# EAGLE design apa104-breakout (EAGLE 9.1.3)
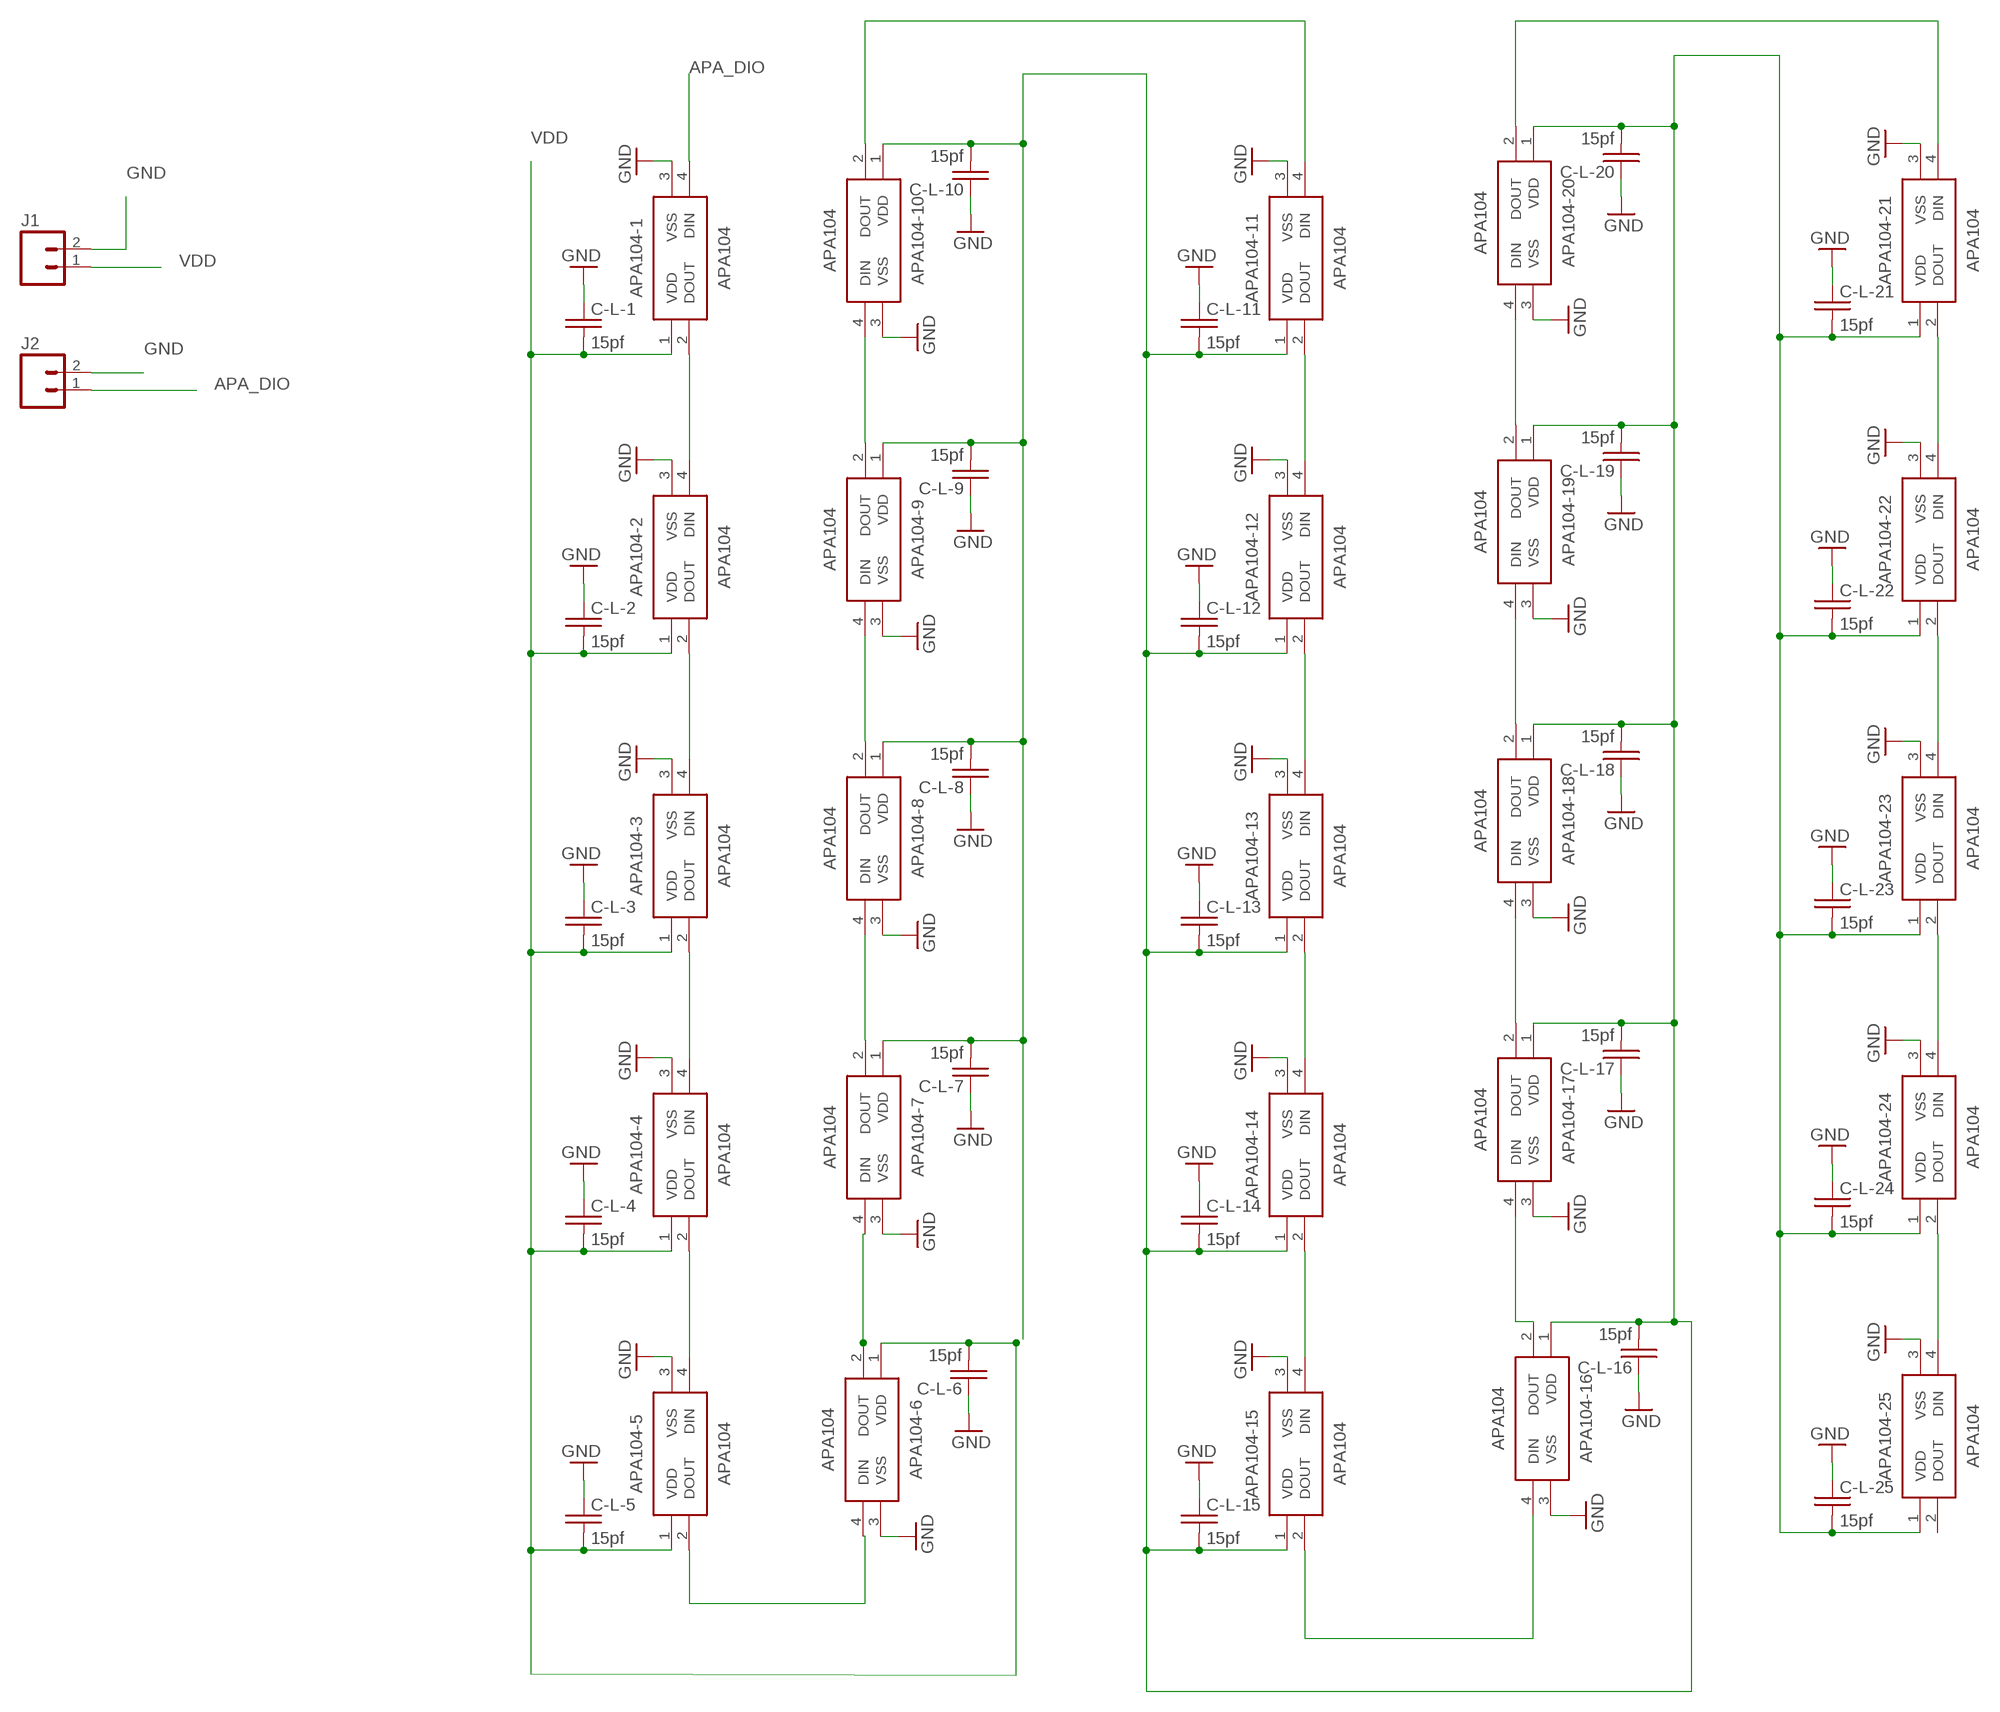
[diagram p0: schematic, sheet 1]

## Parts
APA104-1  APA104  [APA104]
APA104-2  APA104  [APA104]
APA104-3  APA104  [APA104]
APA104-4  APA104  [APA104]
APA104-5  APA104  [APA104]
APA104-6  APA104  [APA104]
APA104-7  APA104  [APA104]
APA104-8  APA104  [APA104]
APA104-9  APA104  [APA104]
APA104-10  APA104  [APA104]
APA104-11  APA104  [APA104]
APA104-12  APA104  [APA104]
APA104-13  APA104  [APA104]
APA104-14  APA104  [APA104]
APA104-15  APA104  [APA104]
APA104-16  APA104  [APA104]
APA104-17  APA104  [APA104]
APA104-18  APA104  [APA104]
APA104-19  APA104  [APA104]
APA104-20  APA104  [APA104]
APA104-21  APA104  [APA104]
APA104-22  APA104  [APA104]
APA104-23  APA104  [APA104]
APA104-24  APA104  [APA104]
APA104-25  APA104  [APA104]
C-L-1  15pf  C-USC0805-VOLTERA  [C0805-VOLTA]
C-L-2  15pf  C-USC0805-VOLTERA  [C0805-VOLTA]
C-L-3  15pf  C-USC0805-VOLTERA  [C0805-VOLTA]
C-L-4  15pf  C-USC0805-VOLTERA  [C0805-VOLTA]
C-L-5  15pf  C-USC0805-VOLTERA  [C0805-VOLTA]
C-L-6  15pf  C-USC0805-VOLTERA  [C0805-VOLTA]
C-L-7  15pf  C-USC0805-VOLTERA  [C0805-VOLTA]
C-L-8  15pf  C-USC0805-VOLTERA  [C0805-VOLTA]
C-L-9  15pf  C-USC0805-VOLTERA  [C0805-VOLTA]
C-L-10  15pf  C-USC0805-VOLTERA  [C0805-VOLTA]
C-L-11  15pf  C-USC0805-VOLTERA  [C0805-VOLTA]
C-L-12  15pf  C-USC0805-VOLTERA  [C0805-VOLTA]
C-L-13  15pf  C-USC0805-VOLTERA  [C0805-VOLTA]
C-L-14  15pf  C-USC0805-VOLTERA  [C0805-VOLTA]
C-L-15  15pf  C-USC0805-VOLTERA  [C0805-VOLTA]
C-L-16  15pf  C-USC0805-VOLTERA  [C0805-VOLTA]
C-L-17  15pf  C-USC0805-VOLTERA  [C0805-VOLTA]
C-L-18  15pf  C-USC0805-VOLTERA  [C0805-VOLTA]
C-L-19  15pf  C-USC0805-VOLTERA  [C0805-VOLTA]
C-L-20  15pf  C-USC0805-VOLTERA  [C0805-VOLTA]
C-L-21  15pf  C-USC0805-VOLTERA  [C0805-VOLTA]
C-L-22  15pf  C-USC0805-VOLTERA  [C0805-VOLTA]
C-L-23  15pf  C-USC0805-VOLTERA  [C0805-VOLTA]
C-L-24  15pf  C-USC0805-VOLTERA  [C0805-VOLTA]
C-L-25  15pf  C-USC0805-VOLTERA  [C0805-VOLTA]
J1  M02PTH  [1X02]
J2  M02PTH  [1X02]

## Nets
APA_DIO: APA104-1.4(DIN) J2.1
GND: APA104-1.3(VSS) APA104-2.3(VSS) APA104-3.3(VSS) APA104-4.3(VSS) APA104-5.3(VSS) APA104-6.3(VSS) APA104-7.3(VSS) APA104-8.3(VSS) APA104-9.3(VSS) APA104-10.3(VSS) APA104-11.3(VSS) APA104-12.3(VSS) APA104-13.3(VSS) APA104-14.3(VSS) APA104-15.3(VSS) APA104-16.3(VSS) APA104-17.3(VSS) APA104-18.3(VSS) APA104-19.3(VSS) APA104-20.3(VSS) APA104-21.3(VSS) APA104-22.3(VSS) APA104-23.3(VSS) APA104-24.3(VSS) APA104-25.3(VSS) C-L-1.1 C-L-2.1 C-L-3.1 C-L-4.1 C-L-5.1 C-L-6.1 C-L-7.1 C-L-8.1 C-L-9.1 C-L-10.1 C-L-11.1 C-L-12.1 C-L-13.1 C-L-14.1 C-L-15.1 C-L-16.1 C-L-17.1 C-L-18.1 C-L-19.1 C-L-20.1 C-L-21.1 C-L-22.1 C-L-23.1 C-L-24.1 C-L-25.1 J1.2 J2.2
N$1: APA104-2.2(DOUT) APA104-3.4(DIN)
N$2: APA104-3.2(DOUT) APA104-4.4(DIN)
N$3: APA104-4.2(DOUT) APA104-5.4(DIN)
N$4: APA104-6.2(DOUT) APA104-7.4(DIN)
N$5: APA104-5.2(DOUT) APA104-6.4(DIN)
N$6: APA104-7.2(DOUT) APA104-8.4(DIN)
N$7: APA104-8.2(DOUT) APA104-9.4(DIN)
N$8: APA104-9.2(DOUT) APA104-10.4(DIN)
N$9: APA104-10.2(DOUT) APA104-11.4(DIN)
N$10: APA104-11.2(DOUT) APA104-12.4(DIN)
N$11: APA104-12.2(DOUT) APA104-13.4(DIN)
N$12: APA104-13.2(DOUT) APA104-14.4(DIN)
N$13: APA104-14.2(DOUT) APA104-15.4(DIN)
N$14: APA104-15.2(DOUT) APA104-16.4(DIN)
N$15: APA104-16.2(DOUT) APA104-17.4(DIN)
N$16: APA104-17.2(DOUT) APA104-18.4(DIN)
N$17: APA104-18.2(DOUT) APA104-19.4(DIN)
N$18: APA104-19.2(DOUT) APA104-20.4(DIN)
N$19: APA104-20.2(DOUT) APA104-21.4(DIN)
N$20: APA104-21.2(DOUT) APA104-22.4(DIN)
N$21: APA104-22.2(DOUT) APA104-23.4(DIN)
N$22: APA104-23.2(DOUT) APA104-24.4(DIN)
N$23: APA104-24.2(DOUT) APA104-25.4(DIN)
N$24: APA104-1.2(DOUT) APA104-2.4(DIN)
VDD: APA104-1.1(VDD) APA104-2.1(VDD) APA104-3.1(VDD) APA104-4.1(VDD) APA104-5.1(VDD) APA104-6.1(VDD) APA104-7.1(VDD) APA104-8.1(VDD) APA104-9.1(VDD) APA104-10.1(VDD) APA104-11.1(VDD) APA104-12.1(VDD) APA104-13.1(VDD) APA104-14.1(VDD) APA104-15.1(VDD) APA104-16.1(VDD) APA104-17.1(VDD) APA104-18.1(VDD) APA104-19.1(VDD) APA104-20.1(VDD) APA104-21.1(VDD) APA104-22.1(VDD) APA104-23.1(VDD) APA104-24.1(VDD) APA104-25.1(VDD) C-L-1.2 C-L-2.2 C-L-3.2 C-L-4.2 C-L-5.2 C-L-6.2 C-L-7.2 C-L-8.2 C-L-9.2 C-L-10.2 C-L-11.2 C-L-12.2 C-L-13.2 C-L-14.2 C-L-15.2 C-L-16.2 C-L-17.2 C-L-18.2 C-L-19.2 C-L-20.2 C-L-21.2 C-L-22.2 C-L-23.2 C-L-24.2 C-L-25.2 J1.1
Unconnected: APA104-25.2(DOUT)

## Library data of the parts
APA104-1-APA104-25 = name-in-lights:APA104: APA104 LED CHIP Source: Datasheet <http://www.ledlightinghut.com/files/APA104%20Datasheet.pdf>; DESCRIPTION: APA104 LED Chip; HEIGHT: mm; MANUFACTURER_NAME: Worldsemi; MANUFACTURER_PART_NUMBER: APA104; SUPPLIER_NAME: RS
C-L-1-C-L-25 = name-in-lights:C-US: CAPACITOR, American symbol
J1 J2 = apa104-test-board:M02: Standard 2-pin 0.1" header. Use with - straight break away headers ( PRT-00116) - right angle break away headers (PRT-00553) - swiss pins (PRT-00743) - machine pins (PRT-00117) - female headers (PRT-00115) Molex polarized connector foot print use with: PRT-08233 with associated crimp pins and housings. 2.54_SCREWTERM for use with PRT-10571. 3.5mm Screw Terminal footprints for PRT-08084 5mm Screw Terminal footprints for use with PRT-08432

## Board
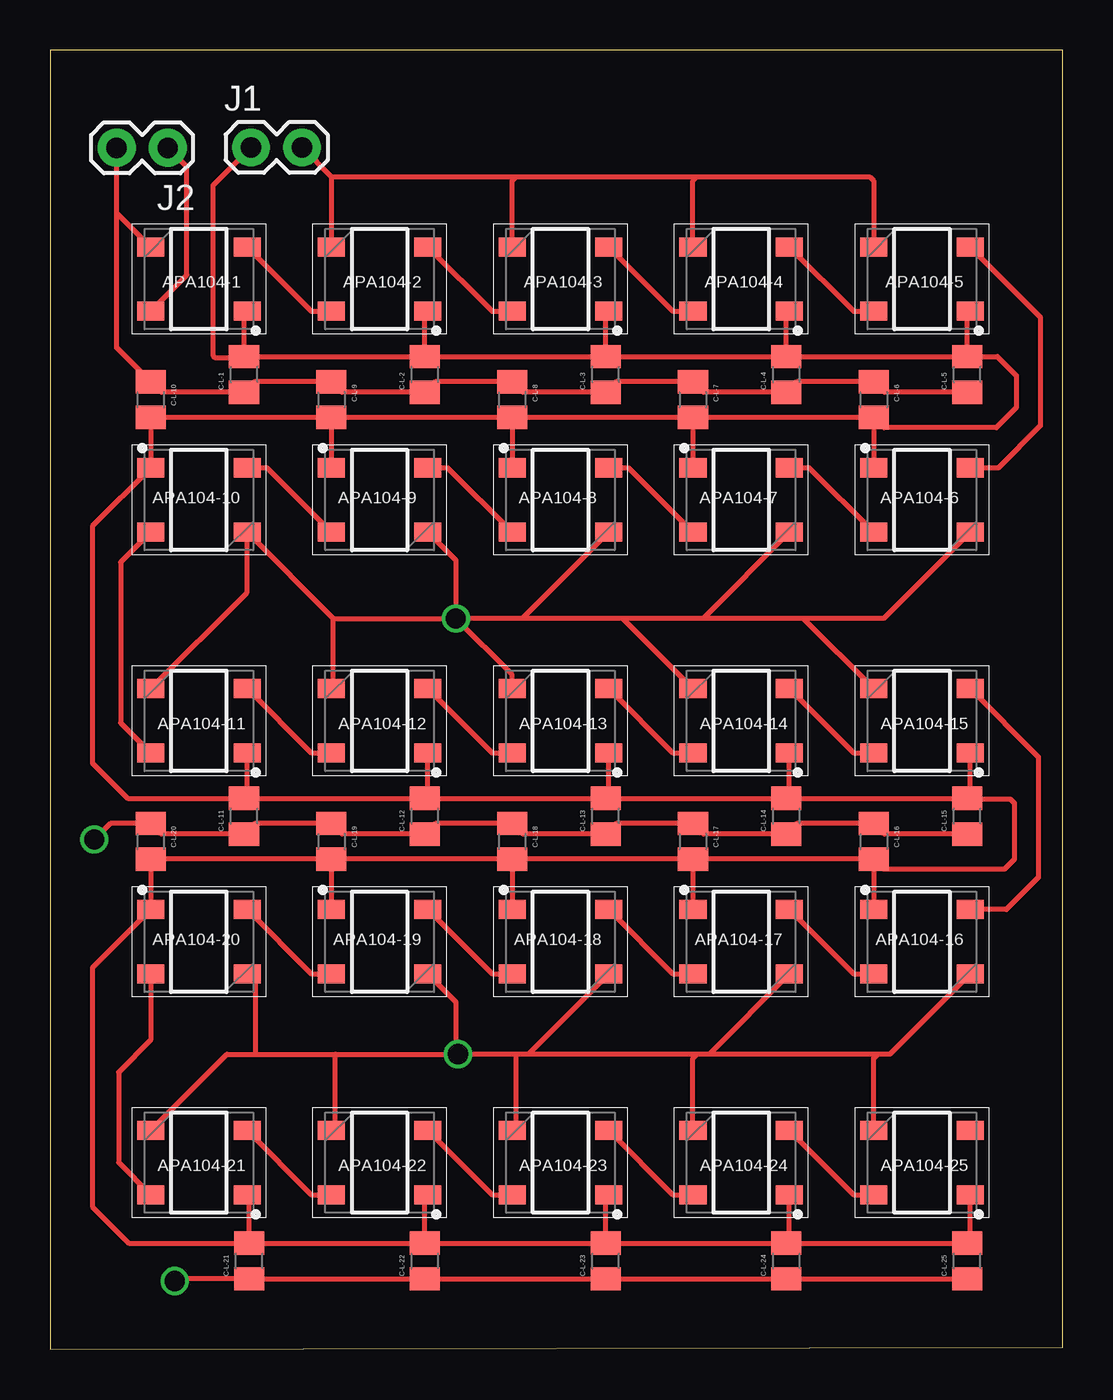
[diagram p1: board, top side]
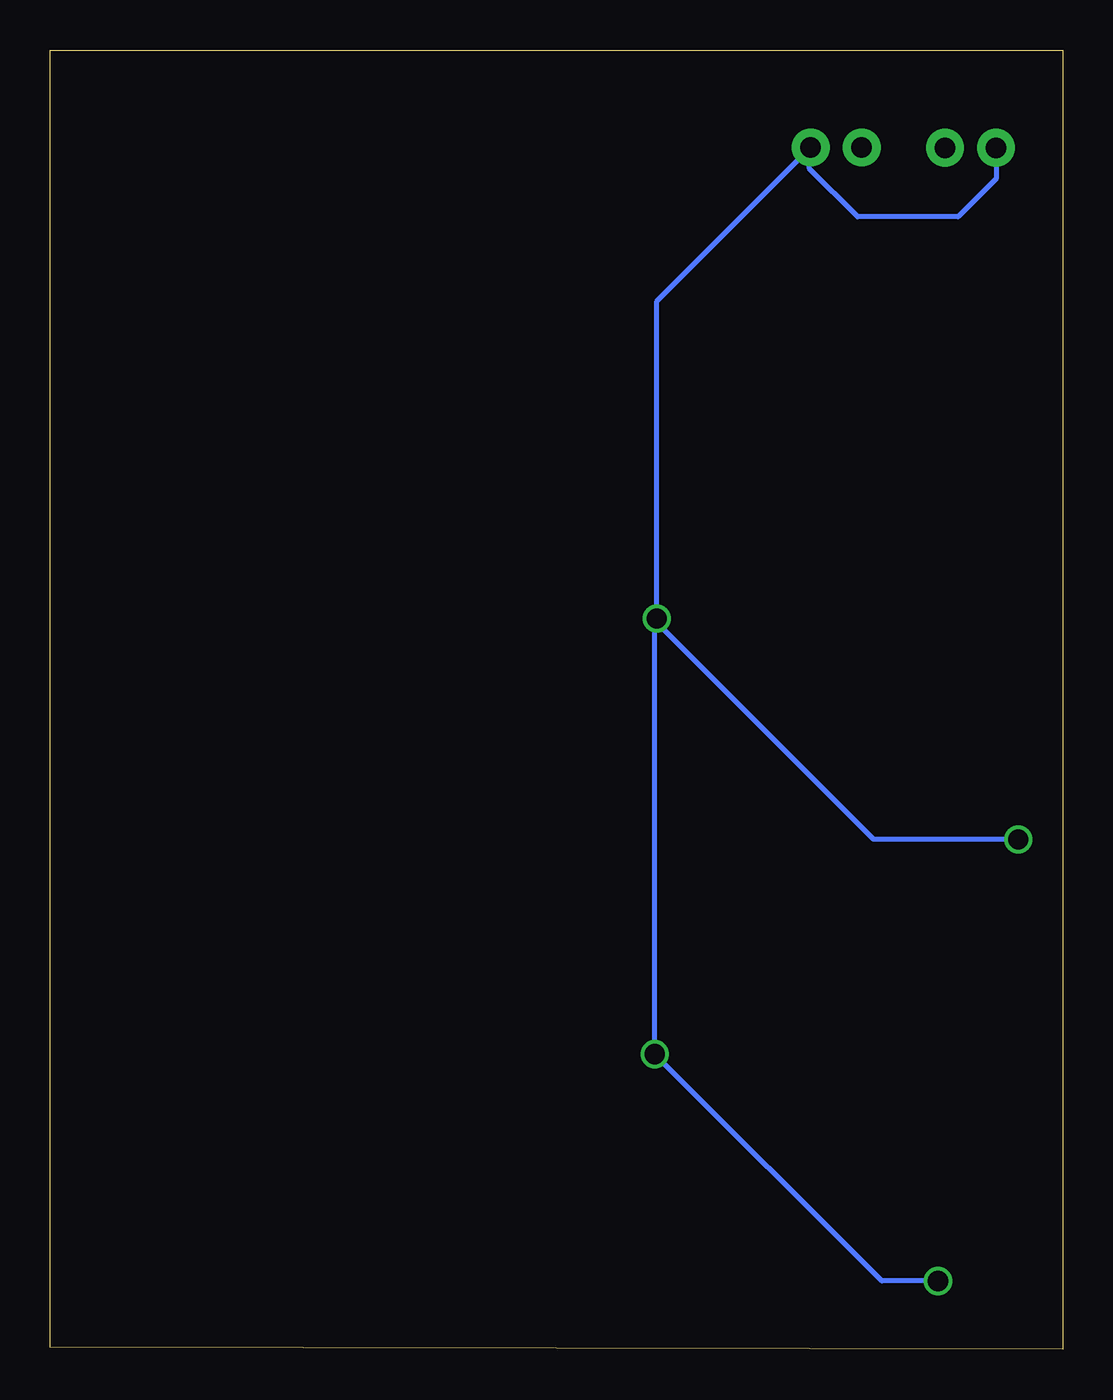
[diagram p2: board, bottom side, seen from below]

Size 50.4 x 64.7 mm. Coordinates in mm from the lower left corner, seen from the top.
Outline: 0,0 50.4,0.1 50.4,64.7 0,64.7 0,0
Copper layers (1*16): Top 0.035mm / dielectric 1.5mm / Bottom 0.035mm
Design rules "Voltera_DRC-my-adds": minimum track width 10mil, minimum drill 0.7mm, track to track 12mil, track to pad 12mil, pad to pad 0.6mm, via to via 0.6mm, smd to smd 0mil, copper to edge 0mil, drill to drill 0.8mm, minimum pad ring 0.2mm, minimum via ring 0.2mm, stop-mask expansion 4mil, vias tented up to drill 0mil, thermal gap 10mil

### Footprints (pad centres in the part's own frame; a part is rotated, then mirrored left to right if it is on the bottom)
APA104 = smd 1.35 x 0.95: 1 -2.4,1.6; 2 -2.4,-1.6; 3 2.4,-1.6; 4 2.4,1.6
C0805-VOLTA = smd 1.168 x 1.499: 1 -0.889,0; 2 0.889,0
1X02 = drill 1.016 pad 1.88: 1 0,0; 2 2.54,0

### Placement (x,y rotation side)
APA104-1  7.4,53.3 180 top
APA104-2  16.4,53.3 180 top
APA104-3  25.4,53.3 180 top
APA104-4  34.4,53.3 180 top
APA104-5  43.4,53.3 180 top
APA104-6  43.4,42.3 0 top
APA104-7  34.4,42.3 0 top
APA104-8  25.4,42.3 0 top
APA104-9  16.4,42.3 0 top
APA104-10  7.4,42.3 0 top
APA104-11  7.4,31.3 180 top
APA104-12  16.4,31.3 180 top
APA104-13  25.4,31.3 180 top
APA104-14  34.4,31.3 180 top
APA104-15  43.4,31.3 180 top
APA104-16  43.4,20.3 0 top
APA104-17  34.4,20.3 0 top
APA104-18  25.4,20.3 0 top
APA104-19  16.4,20.3 0 top
APA104-20  7.4,20.3 0 top
APA104-21  7.4,9.3 180 top
APA104-22  16.4,9.3 180 top
APA104-23  25.4,9.3 180 top
APA104-24  34.4,9.3 180 top
APA104-25  43.4,9.3 180 top
C-L-1  9.65,48.55 90 top
C-L-2  18.65,48.55 90 top
C-L-3  27.65,48.55 90 top
C-L-4  36.65,48.55 90 top
C-L-5  45.65,48.55 90 top
C-L-6  41,47.3 270 top
C-L-7  32,47.3 270 top
C-L-8  23,47.3 270 top
C-L-9  14,47.3 270 top
C-L-10  5,47.3 270 top
C-L-11  9.65,26.55 90 top
C-L-12  18.65,26.55 90 top
C-L-13  27.65,26.55 90 top
C-L-14  36.65,26.55 90 top
C-L-15  45.65,26.55 90 top
C-L-16  41,25.3 270 top
C-L-17  32,25.3 270 top
C-L-18  23,25.3 270 top
C-L-19  14,25.3 270 top
C-L-20  5,25.3 270 top
C-L-21  9.9,4.4 90 top
C-L-22  18.65,4.4 90 top
C-L-23  27.65,4.4 90 top
C-L-24  36.65,4.4 90 top
C-L-25  45.65,4.4 90 top
J1  10,59.86 0 top
J2  5.85,59.84 180 top

### Tracks (layer width: path | path; a pad name or v marks a point on that pad's centre or on a via)
APA_DIO
  Top 0.254: APA104-1.4 6.8,53.5 6.8,58.89 J2.1
GND  (via drill 1)
  Top 0.254: J1.2 14,58.4 | 14,58.4 APA104-2.3 | 14,58.4 23.2,58.4 | 23.2,58.4 32.2,58.4 | C-L-5.1 41.53,47.66 C-L-6.1 37.18,48.19 C-L-4.1 32.53,47.66 C-L-7.1 28.18,48.19 C-L-3.1 23.53,47.66 C-L-8.1 19.18,48.19 C-L-2.1 14.53,47.66 C-L-9.1 10.18,48.19 C-L-1.1 5.53,47.66 5.09,48.09 C-L-10.1 3.31,49.88 3.31,56.59 | APA104-11.3 9.8,37.7 APA104-10.3 14.1,36.4 | C-L-15.1 41.53,25.66 C-L-16.1 37.18,26.19 C-L-14.1 32.53,25.66 C-L-17.1 28.18,26.19 C-L-13.1 23.53,25.66 C-L-18.1 19.18,26.19 C-L-12.1 14.53,25.66 C-L-19.1 10.18,26.19 C-L-11.1 5.53,25.66 C-L-20.1 2.99,26.19 v2.2,25.4 | C-L-25.1 C-L-24.1 C-L-23.1 C-L-22.1 C-L-21.1 6.31,3.51 v6.2,3.4 | 23.2,11.1 APA104-23.3 23.2,11.1 | APA104-3.3 23,58.2 23.2,58.4 | APA104-4.3 32,58.2 32.2,58.4 | APA104-5.3 41,58.2 40.8,58.4 32.2,58.4 | APA104-9.3 20.2,39.3 v20.2,36.4 | 14.1,36.4 v20.2,36.4 | APA104-12.3 14.1,33 14.1,36.4 | APA104-13.3 23,33.6 v20.2,36.4 | APA104-8.3 23.5,36.4 | 23.5,36.4 v20.2,36.4 | APA104-7.3 32.5,36.4 32.2,36.4 | 32.2,36.4 27.2,36.4 | 27.2,36.4 23.5,36.4 | APA104-14.3 28.5,36.4 27.2,36.4 | APA104-6.3 41.5,36.4 37.2,36.4 | 37.2,36.4 32.2,36.4 | APA104-15.3 37.5,36.4 37.2,36.4 | APA104-21.3 8.8,14.7 10.2,14.7 | 10.2,14.7 14.2,14.7 | 14.2,14.7 20.2,14.7 | 20.2,14.7 v20.3,14.7 | APA104-20.3 10.2,18.3 10.2,14.7 | APA104-22.3 14.2,11.1 14.2,14.7 | 20.2,14.7 20.2,17.3 APA104-19.3 | APA104-18.3 23.8,14.7 23.2,14.7 | 23.2,14.7 20.2,14.7 | 23.2,11.1 23.2,14.7 | APA104-17.3 32.8,14.7 32.2,14.7 | 32.2,14.7 23.2,14.7 | APA104-24.3 32,14.5 32.2,14.7 | APA104-16.3 41.8,14.7 41.2,14.7 | 41.2,14.7 32.2,14.7 | APA104-25.3 41,14.5 41.2,14.7 | APA104-1.3 3.31,56.59 | 3.31,56.59 J2.2
  Bottom 0.254: v6.2,3.4 9,3.4 v20.3,14.7 20.3,36.3 | 20.3,36.3 v20.2,36.4 20.2,52.2 12.6,59.8 | 12.6,59.8 J1.2 | J2.2 3.31,58.29 5.2,56.4 10.2,56.4 12.6,58.8 12.6,59.8 | v2.2,25.4 9.4,25.4 20.3,36.3
N$1
  Top 0.254: APA104-2.2 22,51.7 APA104-3.4
N$2
  Top 0.254: APA104-3.2 31,51.7 APA104-4.4
N$3
  Top 0.254: APA104-4.2 40,51.7 APA104-5.4
N$4
  Top 0.254: APA104-6.2 37.8,43.9 APA104-7.4
N$5
  Top 0.254: APA104-5.2 49.3,51.4 49.3,46 47.2,43.9 APA104-6.4
N$6
  Top 0.254: APA104-7.2 28.8,43.9 APA104-8.4
N$7
  Top 0.254: APA104-8.2 19.8,43.9 APA104-9.4
N$8
  Top 0.254: APA104-9.2 10.8,43.9 APA104-10.4
N$9
  Top 0.254: APA104-10.2 3.5,39.2 3.5,31.2 APA104-11.4
N$10
  Top 0.254: APA104-11.2 13,29.7 APA104-12.4
N$11
  Top 0.254: APA104-12.2 22,29.7 APA104-13.4
N$12
  Top 0.254: APA104-13.2 31,29.7 APA104-14.4
N$13
  Top 0.254: APA104-14.2 40,29.7 APA104-15.4
N$14
  Top 0.254: APA104-15.2 49.2,29.5 49.2,23.5 47.6,21.9 APA104-16.4
N$15
  Top 0.254: APA104-17.4 40,18.7 APA104-16.2
N$16
  Top 0.254: APA104-18.4 31,18.7 APA104-17.2
N$17
  Top 0.254: APA104-19.4 22,18.7 APA104-18.2
N$18
  Top 0.254: APA104-20.4 13,18.7 APA104-19.2
N$19
  Top 0.254: APA104-20.2 5,15.4 3.4,13.8 3.4,9.3 APA104-21.4
N$20
  Top 0.254: APA104-21.2 13,7.7 APA104-22.4
N$21
  Top 0.254: APA104-22.2 22,7.7 APA104-23.4
N$22
  Top 0.254: APA104-23.2 31,7.7 APA104-24.4
N$23
  Top 0.254: APA104-24.2 40,7.7 APA104-25.4
N$24
  Top 0.254: APA104-1.2 13,51.7 APA104-2.4
VDD
  Top 0.254: J1.1 8.1,57.96 8.1,49.5 8.2,49.4 9.61,49.4 C-L-1.2 | C-L-1.2 C-L-2.2 | C-L-2.2 C-L-3.2 | C-L-3.2 C-L-4.2 | C-L-4.2 C-L-5.2 | C-L-1.2 9.65,51.55 APA104-1.1 | C-L-2.2 18.65,51.55 APA104-2.1 | C-L-3.2 27.65,51.55 APA104-3.1 | C-L-4.2 36.65,51.55 APA104-4.1 | C-L-5.2 45.65,51.55 APA104-5.1 | C-L-5.2 47.16,49.44 48.1,48.5 48.1,46.9 47.1,45.9 41.51,45.9 C-L-6.2 | C-L-6.2 C-L-7.2 | C-L-7.2 C-L-8.2 | C-L-8.2 C-L-9.2 | C-L-9.2 C-L-10.2 APA104-10.1 2.1,41 2.1,29.2 3.86,27.44 C-L-11.2 | C-L-6.2 APA104-6.1 | C-L-7.2 APA104-7.1 | C-L-8.2 APA104-8.1 | C-L-9.2 APA104-9.1 | C-L-11.2 C-L-12.2 | C-L-12.2 C-L-13.2 | C-L-13.2 C-L-14.2 | C-L-14.2 C-L-15.2 | C-L-11.2 9.8,27.59 APA104-11.1 | C-L-12.2 18.8,27.59 APA104-12.1 | C-L-13.2 27.8,27.59 APA104-13.1 | C-L-14.2 36.8,27.59 APA104-14.1 | C-L-15.2 45.8,27.59 APA104-15.1 | C-L-15.2 45.69,27.4 47.8,27.4 48,27.2 48,24.4 47.5,23.9 41.51,23.9 C-L-16.2 | C-L-16.2 C-L-17.2 | C-L-17.2 C-L-18.2 | C-L-18.2 C-L-19.2 | C-L-19.2 C-L-20.2 APA104-20.1 2.1,19 2.1,7.1 3.91,5.29 C-L-21.2 | C-L-19.2 APA104-19.1 | C-L-18.2 APA104-18.1 | C-L-17.2 APA104-17.1 | C-L-16.2 APA104-16.1 | C-L-21.2 C-L-22.2 | C-L-22.2 C-L-23.2 | C-L-23.2 C-L-24.2 | C-L-24.2 36.8,5.44 APA104-24.1 | C-L-23.2 27.65,7.55 APA104-23.1 | C-L-22.2 18.65,7.55 APA104-22.1 | C-L-21.2 9.9,7.6 APA104-21.1 | C-L-24.2 C-L-25.2 45.8,5.44 APA104-25.1